# Altium schematic sheet Left Channel Audio.SchDoc: Left Channel Audio
size A4; Organization: Altium Limited; Address1: L3, 12a Rodborough Rd; Address2: Frenchs Forest; Address3: NSW; Address4: Australia 2086; Revision: 1; SheetNumber: 10; SheetTotal: 11; Alumno: Diego Caceres; Curso: R1051; Materia: Sistemas de Representación; Docentes: Ing. Perdomo, Ing. Fuoco, Ing. Giorno, Sr. Vergili
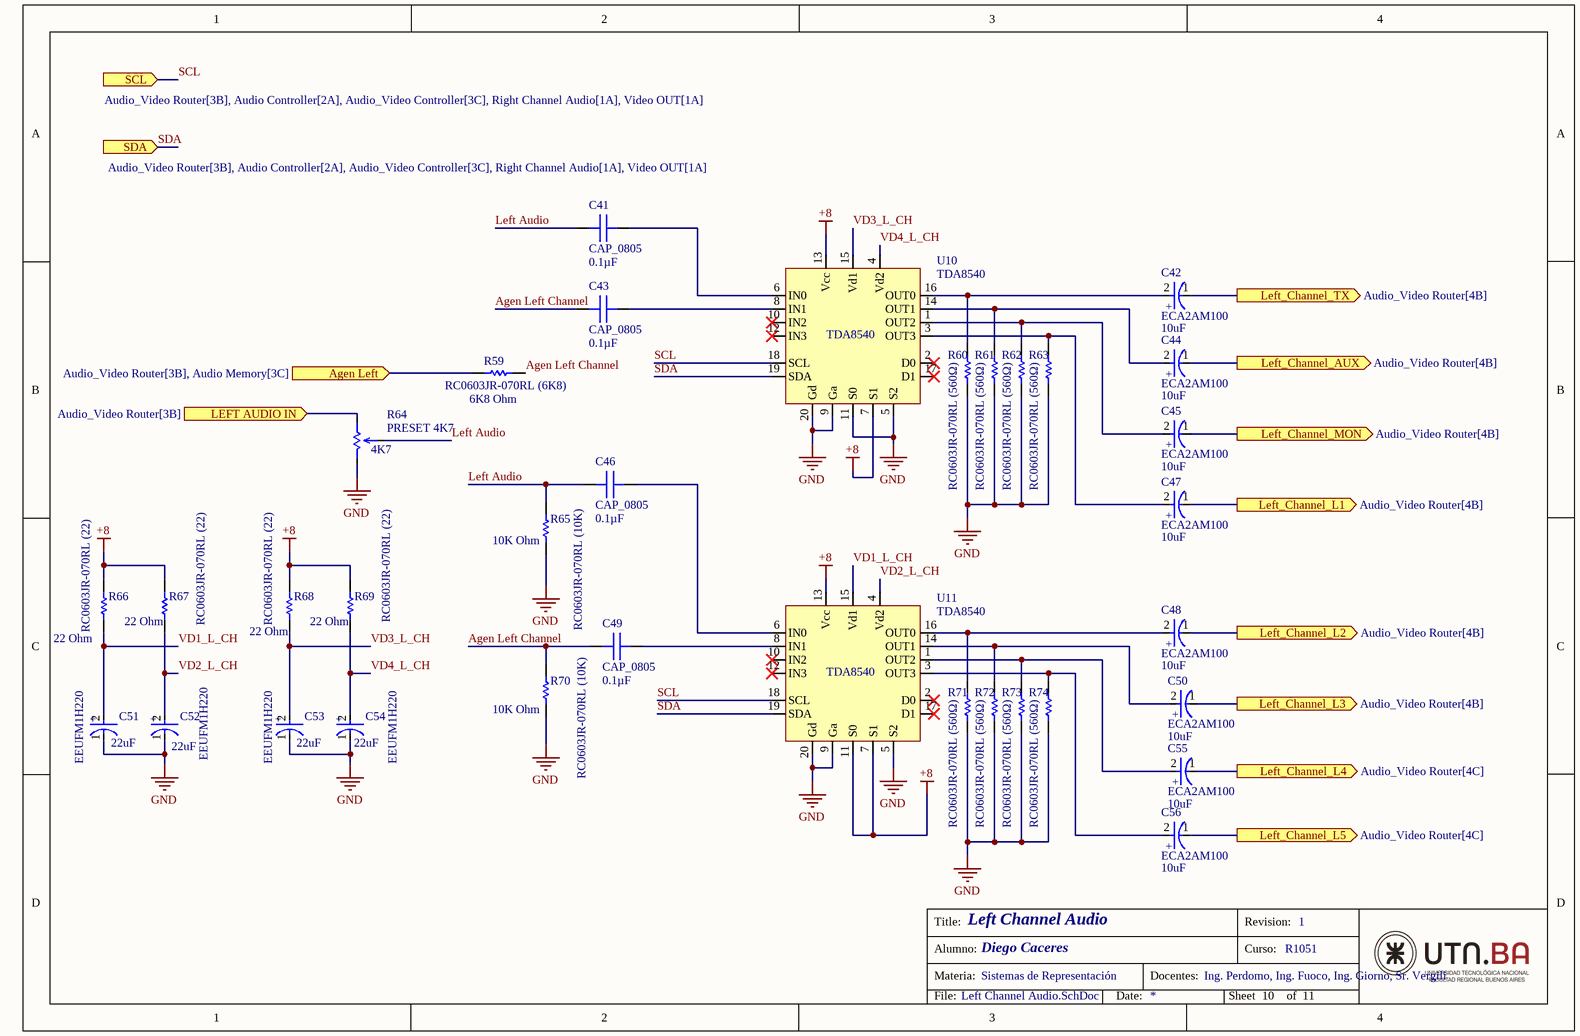
[diagram p0: Left Channel Audio.SchDoc]

## Parts
C41  CAP_0805  value 0.1µF  [0805_CAPACITOR_DCACERES]
C42  ECA2AM100  Capacitance: 10uF  [FP-RAD-TH-D_5_0_5-L_11_1-MFG]
C43  CAP_0805  value 0.1µF  [0805_CAPACITOR_DCACERES]
C44  ECA2AM100  Capacitance: 10uF  [FP-RAD-TH-D_5_0_5-L_11_1-MFG]
C45  ECA2AM100  Capacitance: 10uF  [FP-RAD-TH-D_5_0_5-L_11_1-MFG]
C46  CAP_0805  value 0.1µF  [0805_CAPACITOR_DCACERES]
C47  ECA2AM100  Capacitance: 10uF  [FP-RAD-TH-D_5_0_5-L_11_1-MFG]
C48  ECA2AM100  Capacitance: 10uF  [FP-RAD-TH-D_5_0_5-L_11_1-MFG]
C49  CAP_0805  value 0.1µF  [0805_CAPACITOR_DCACERES]
C50  ECA2AM100  Capacitance: 10uF  [FP-RAD-TH-D_5_0_5-L_11_1-MFG]
C51  EEUFM1H220  Capacitance: 22uF  [FP-RAD-TH-D_5_0_5-L_11_1-MFG]
C52  EEUFM1H220  Capacitance: 22uF  [FP-RAD-TH-D_5_0_5-L_11_1-MFG]
C53  EEUFM1H220  Capacitance: 22uF  [FP-RAD-TH-D_5_0_5-L_11_1-MFG]
C54  EEUFM1H220  Capacitance: 22uF  [FP-RAD-TH-D_5_0_5-L_11_1-MFG]
C55  ECA2AM100  Capacitance: 10uF  [FP-RAD-TH-D_5_0_5-L_11_1-MFG]
C56  ECA2AM100  Capacitance: 10uF  [FP-RAD-TH-D_5_0_5-L_11_1-MFG]
R59  RC0603JR-070RL (6K8)  Resistance: 6K8 Ohm  [RESC1608X55X25ML10T15]
R60  RC0603JR-070RL (560Ω)  [RESC1608X55X25ML10T15]
R61  RC0603JR-070RL (560Ω)  [RESC1608X55X25ML10T15]
R62  RC0603JR-070RL (560Ω)  [RESC1608X55X25ML10T15]
R63  RC0603JR-070RL (560Ω)  [RESC1608X55X25ML10T15]
R64  PRESET 4K7  value 4K7  [3386P_PRESET_4K7_DCaceres]
R65  RC0603JR-070RL (10K)  Resistance: 10K Ohm  [RESC1608X55X25ML10T15]
R66  RC0603JR-070RL (22)  Resistance: 22 Ohm  [RESC1608X55X25ML10T15]
R67  RC0603JR-070RL (22)  Resistance: 22 Ohm  [RESC1608X55X25ML10T15]
R68  RC0603JR-070RL (22)  Resistance: 22 Ohm  [RESC1608X55X25ML10T15]
R69  RC0603JR-070RL (22)  Resistance: 22 Ohm  [RESC1608X55X25ML10T15]
R70  RC0603JR-070RL (10K)  Resistance: 10K Ohm  [RESC1608X55X25ML10T15]
R71  RC0603JR-070RL (560Ω)  [RESC1608X55X25ML10T15]
R72  RC0603JR-070RL (560Ω)  [RESC1608X55X25ML10T15]
R73  RC0603JR-070RL (560Ω)  [RESC1608X55X25ML10T15]
R74  RC0603JR-070RL (560Ω)  [RESC1608X55X25ML10T15]
U10  TDA8540  [SOT146-1_DIP20_TDA8540_DCACERES]
U11  TDA8540  [SOT146-1_DIP20_TDA8540_DCACERES]

## Ports
Agen Left (in, see Audio_Video Router[3B], Audio Memory[3C]), LEFT AUDIO IN (in, see Audio_Video Router[3B]), Left_Channel_AUX (out, see Audio_Video Router[4B]), Left_Channel_L1 (out, see Audio_Video Router[4B]), Left_Channel_L2 (out, see Audio_Video Router[4B]), Left_Channel_L3 (out, see Audio_Video Router[4B]), Left_Channel_L4 (out, see Audio_Video Router[4C]), Left_Channel_L5 (out, see Audio_Video Router[4C]), Left_Channel_MON (out, see Audio_Video Router[4B]), Left_Channel_TX (out, see Audio_Video Router[4B]), SCL (in, see Audio_Video Router[3B], Audio Controller[2A], Audio_Video Controller[3C], Right Channel Audio[1A], Video OUT[1A]), SDA (in, see Audio_Video Router[3B], Audio Controller[2A], Audio_Video Controller[3C], Right Channel Audio[1A], Video OUT[1A])

## Nets
+8: R66.2 R67.2 R68.2 R69.2 U10.7(S1) U10.13(Vcc) U11.7(S1) U11.11(S0) U11.13(Vcc)
GND: C51.1(C) C52.1(C) C53.1(C) C54.1(C) R60.2 R61.2 R62.2 R63.2 R64.1 R65.1 R70.1 R71.2 R72.2 R73.2 R74.2 U10.5(S2) U10.9(Ga) U10.11(S0) U10.20(Gd) U11.5(S2) U11.9(Ga) U11.20(Gd)
Agen Left: R59.1 ; port Agen Left
Agen Left Channel: C43.1 C49.1 R59.2 R70.2
Left Audio: C41.1 C46.1 R64.3 R65.2
LEFT AUDIO IN: R64.2 ; port LEFT AUDIO IN
Left_Channel_AUX: C44.1(C) ; port Left_Channel_AUX
Left_Channel_L1: C47.1(C) ; port Left_Channel_L1
Left_Channel_L2: C48.1(C) ; port Left_Channel_L2
Left_Channel_L3: C50.1(C) ; port Left_Channel_L3
Left_Channel_L4: C55.1(C) ; port Left_Channel_L4
Left_Channel_L5: C56.1(C) ; port Left_Channel_L5
Left_Channel_MON: C45.1(C) ; port Left_Channel_MON
Left_Channel_TX: C42.1(C) ; port Left_Channel_TX
SCL: U10.18(SCL) U11.18(SCL) ; port SCL
SDA: U10.19(SDA) U11.19(SDA) ; port SDA
VD1_L_CH: C51.2(A) R66.1 U11.15(Vd1)
VD2_L_CH: C52.2(A) R67.1 U11.4(Vd2)
VD3_L_CH: C53.2(A) R68.1 U10.15(Vd1)
VD4_L_CH: C54.2(A) R69.1 U10.4(Vd2)
NetC41_2: C41.2 U10.6(IN0)
NetC42_2: C42.2(A) R60.1 U10.16(OUT0)
NetC43_2: C43.2 U10.8(IN1)
NetC44_2: C44.2(A) R61.1 U10.14(OUT1)
NetC45_2: C45.2(A) R62.1 U10.1(OUT2)
NetC46_2: C46.2 U11.6(IN0)
NetC47_2: C47.2(A) R63.1 U10.3(OUT3)
NetC48_2: C48.2(A) R71.1 U11.16(OUT0)
NetC49_2: C49.2 U11.8(IN1)
NetC50_2: C50.2(A) R72.1 U11.14(OUT1)
NetC55_2: C55.2(A) R73.1 U11.1(OUT2)
NetC56_2: C56.2(A) R74.1 U11.3(OUT3)

Not connected (* = marked no-connect by the designer): U10 2(D0)* 10(IN2)* 12(IN3)* 17(D1)*; U11 2(D0)* 10(IN2)* 12(IN3)* 17(D1)*

## Notes on the sheet
- Title:
- Revision:
- Alumno:
- Materia:
- Docentes:
- Curso:
- File:
- Date:
- Sheet
- of
- (in symbol CMP-05427-000661-1) +
- (in symbol CMP-05427-000869-1) +

## Library data of the parts
C41 C43 C46 C49 = CAPACITOR_0805_Caceres: Capacitor SMD, encapsulado 0805; SizePackage: 0805; ComponentLink1Description: Datasheet1; ComponentLink1URL: https://www.mouser.com/datasheet/2/40/AutoMLCCKAM-3216307.pdf; ComponentLink2Description: Datasheet2; ComponentLink2URL: https://www.mouser.com/datasheet/2/447/KEM_C1086_U2J-3316409.pdf; ComponentLink3Description: Datasheet3; ComponentLink3URL: https://product.tdk.com/system/files/dam/doc/product/capacitor/ceramic/mlcc/catalog/mlcc_commercial_soft_en.pdf
C42 C44 C45 C47 C48 C50 C55 C56 = CMP-05427-000869-1: Aluminum Electrolytic Capacitors (Radial Lead Type) 10uF ±20% 100V; Polarity: Polar; Lead Diameter: 0.5mm; Dissipation Factor: 0.1%; Leakage Current: 3uA; Dielectric Material: Aluminium; Ripple Current: 70mA; Life (Hours): 2000Hour; Lead/Base Style: Straight; Length: 11mm; Case/Package: Radial; Lead Pitch: 2mm; Contact Plating: Tin; RoHS Compliant: Yes; Radiation Hardening: No; Max Operating Temperature: 85°C; Lead Free: Lead Free; Termination: Radial; Voltage Rating: 100V; Package Quantity: 200; Voltage: 100V; Construction: RADIAL; Height: 11mm; Min Operating Temperature: -40°C; Diameter: 5mm; REACH SVHC: No SVHC; Tolerance: 20%; Width: 5mm; Height - Seated (Max): 0.472inch; Mount: Through Hole; Series: M; Voltage Rating (DC): 100V; Packaging: Bulk; Ripple Current (AC): 70mA; Number of Pins: 2
C51-C54 = CMP-05427-000661-1: Aluminum Electrolytic Capacitors (Radial Lead Type) 22uF ±20% 50V; Impedance: 340mR; Life (Hours): 2000Hour; Dissipation Factor: 0.1%; Ripple Current: 250mA; Lead Diameter: 0.5mm; REACH SVHC: No SVHC; Tolerance: 20%; Max Operating Temperature: 105°C; RoHS Compliant: Yes; Height - Seated (Max): 0.492inch; Number of Pins: 2; Case/Package: Radial; Series: FM; ESR (Equivalent Series Resistance): 340mR; Length: 11mm; Radiation Hardening: No; Voltage: 50V; Min Operating Temperature: -40°C; Voltage Rating: 50V; Voltage Rating (DC): 50V; Lead Free: Lead Free; Package Quantity: 200; Lead Pitch: 2mm; Height: 11mm; Mount: Through Hole; Construction: RADIAL; Termination: Radial; Diameter: 5mm; Packaging: Bulk
R59 R65-R70 = CMP-2100-03667-1: Chip Resistor, 0 Ohm, +/- 5%, 0.1 W, -55 to 155 degC, 0603 (1608 Metric), RoHS, Tape and Reel; Manufacturer: Yageo; Temperature Coefficient: 200ppm/degreesC; Voltage Rating: 50V; Power Rating: 100mW; Width: 0.8mm; Max Operating Temperature: 155degC; Tolerance: 5%; Package Reference: 0603; Height: 0.45mm; Depth: 0.8mm; Package Description: 2-Pin Surface Mount Device, Body 1.6 x 0.8 mm; Termination: SMD/SMT; Package Quantity: 5000; Case/Package: 0603; Case Code (Imperial): 0603; Radiation Hardening: No; Number of Pins: 2; Length: 1.6mm; Lead Free: LeadFree; Voltage Rating (DC): 50V; Military Standard: Not; Datasheet URL: http://www.yageo.com/NewPortal/yageodocoutput?fileName=/pdf/R-Chip/PYu-RC_Group_51_RoHS_L_5.pdf; Manufacturer URL: http://www.yageo.com/; Packaging: TapeandReel; Case Code (Metric): 1608; Min Operating Temperature: -55degC; Composition: ThickFilm; RoHSCompliant: true; Contact Plating: Tin; Datasheet Version: Rev. 5, 10/2016; REACH SVHC: NoSVHC
R60-R63 R71-R74 = CMP-2100-03667-1: Chip Resistor, 0 Ohm, +/- 5%, 0.1 W, -55 to 155 degC, 0603 (1608 Metric), RoHS, Tape and Reel; Manufacturer: Yageo; Temperature Coefficient: 200ppm/degreesC; Voltage Rating: 50V; Power Rating: 100mW; Resistance: 560 Ohm; Width: 0.8mm; Max Operating Temperature: 155degC; Tolerance: 5%; Package Reference: 0603; Height: 0.45mm; Depth: 0.8mm; Package Description: 2-Pin Surface Mount Device, Body 1.6 x 0.8 mm; Termination: SMD/SMT; Package Quantity: 5000; Case/Package: 0603; Case Code (Imperial): 0603; Radiation Hardening: No; Number of Pins: 2; Length: 1.6mm; Lead Free: LeadFree; Voltage Rating (DC): 50V; Military Standard: Not; Datasheet URL: http://www.yageo.com/NewPortal/yageodocoutput?fileName=/pdf/R-Chip/PYu-RC_Group_51_RoHS_L_5.pdf; Manufacturer URL: http://www.yageo.com/; Packaging: TapeandReel; Case Code (Metric): 1608; Min Operating Temperature: -55degC; Composition: ThickFilm; RoHSCompliant: true; Contact Plating: Tin; Datasheet Version: Rev. 5, 10/2016; REACH SVHC: NoSVHC
R64 = Preset_4K7_Caceres: Preset 4K7, Thru HoleManufacturer Part Search 3386P-1-472LF; PartNumber: 3386P-1-472LF; ComponentLink1Description: Package Specification; ComponentLink1URL: https://ar.mouser.com/datasheet/2/54/3386-776606.pdf; ComponentLink2Description: URL Link; ComponentLink2URL: https://www.mouser.com/ProductDetail/Bourns/3386P-1-472LF?qs=g1MxsQ5vwlSvqan31esVSg%3D%3D
U10 U11 = TDA8540_Caceres: TDA8540, Thtu Hole / Plastic dual in-line package; 20 leads (300 mil); DIP20; SOT146-1.; ComponentLink1Description: Datasheet; ComponentLink1URL: https://pdf1.alldatasheet.es/datasheet-pdf/view/19499/PHILIPS/TDA8540.html; ComponentLink2Description: URL Link; ComponentLink2URL: https://www.nxp.com/products/no-longer-manufactured/tda8540t:TDA8540T; ComponentLink3Description: Discontinuation Notice; ComponentLink3URL: https://www.nxp.com/wcm_documents/products/eol/dn46exha.pdf; ComponentLink4Description: Package Specification; ComponentLink4URL: https://html.alldatasheet.es/html-pdf/19499/PHILIPS/TDA8540/3258/13/TDA8540.html; PartNumber: TDA8540; PackageReference: DIP20; Status: Discontinued